# EAGLE design circuit (EAGLE 7.5.0)
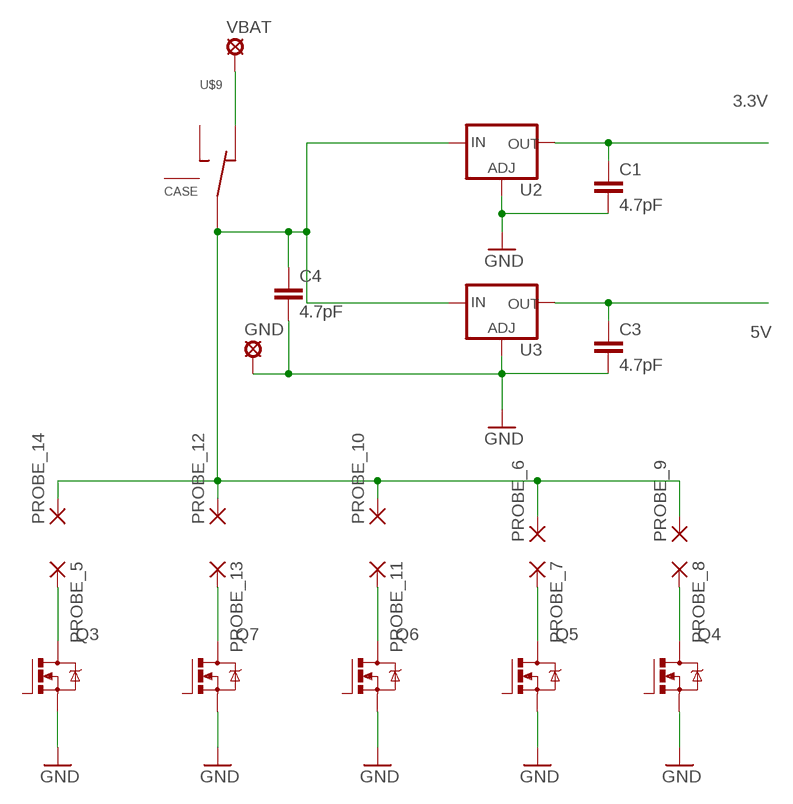
[diagram p0: schematic, sheet 1, part 1 of 2]
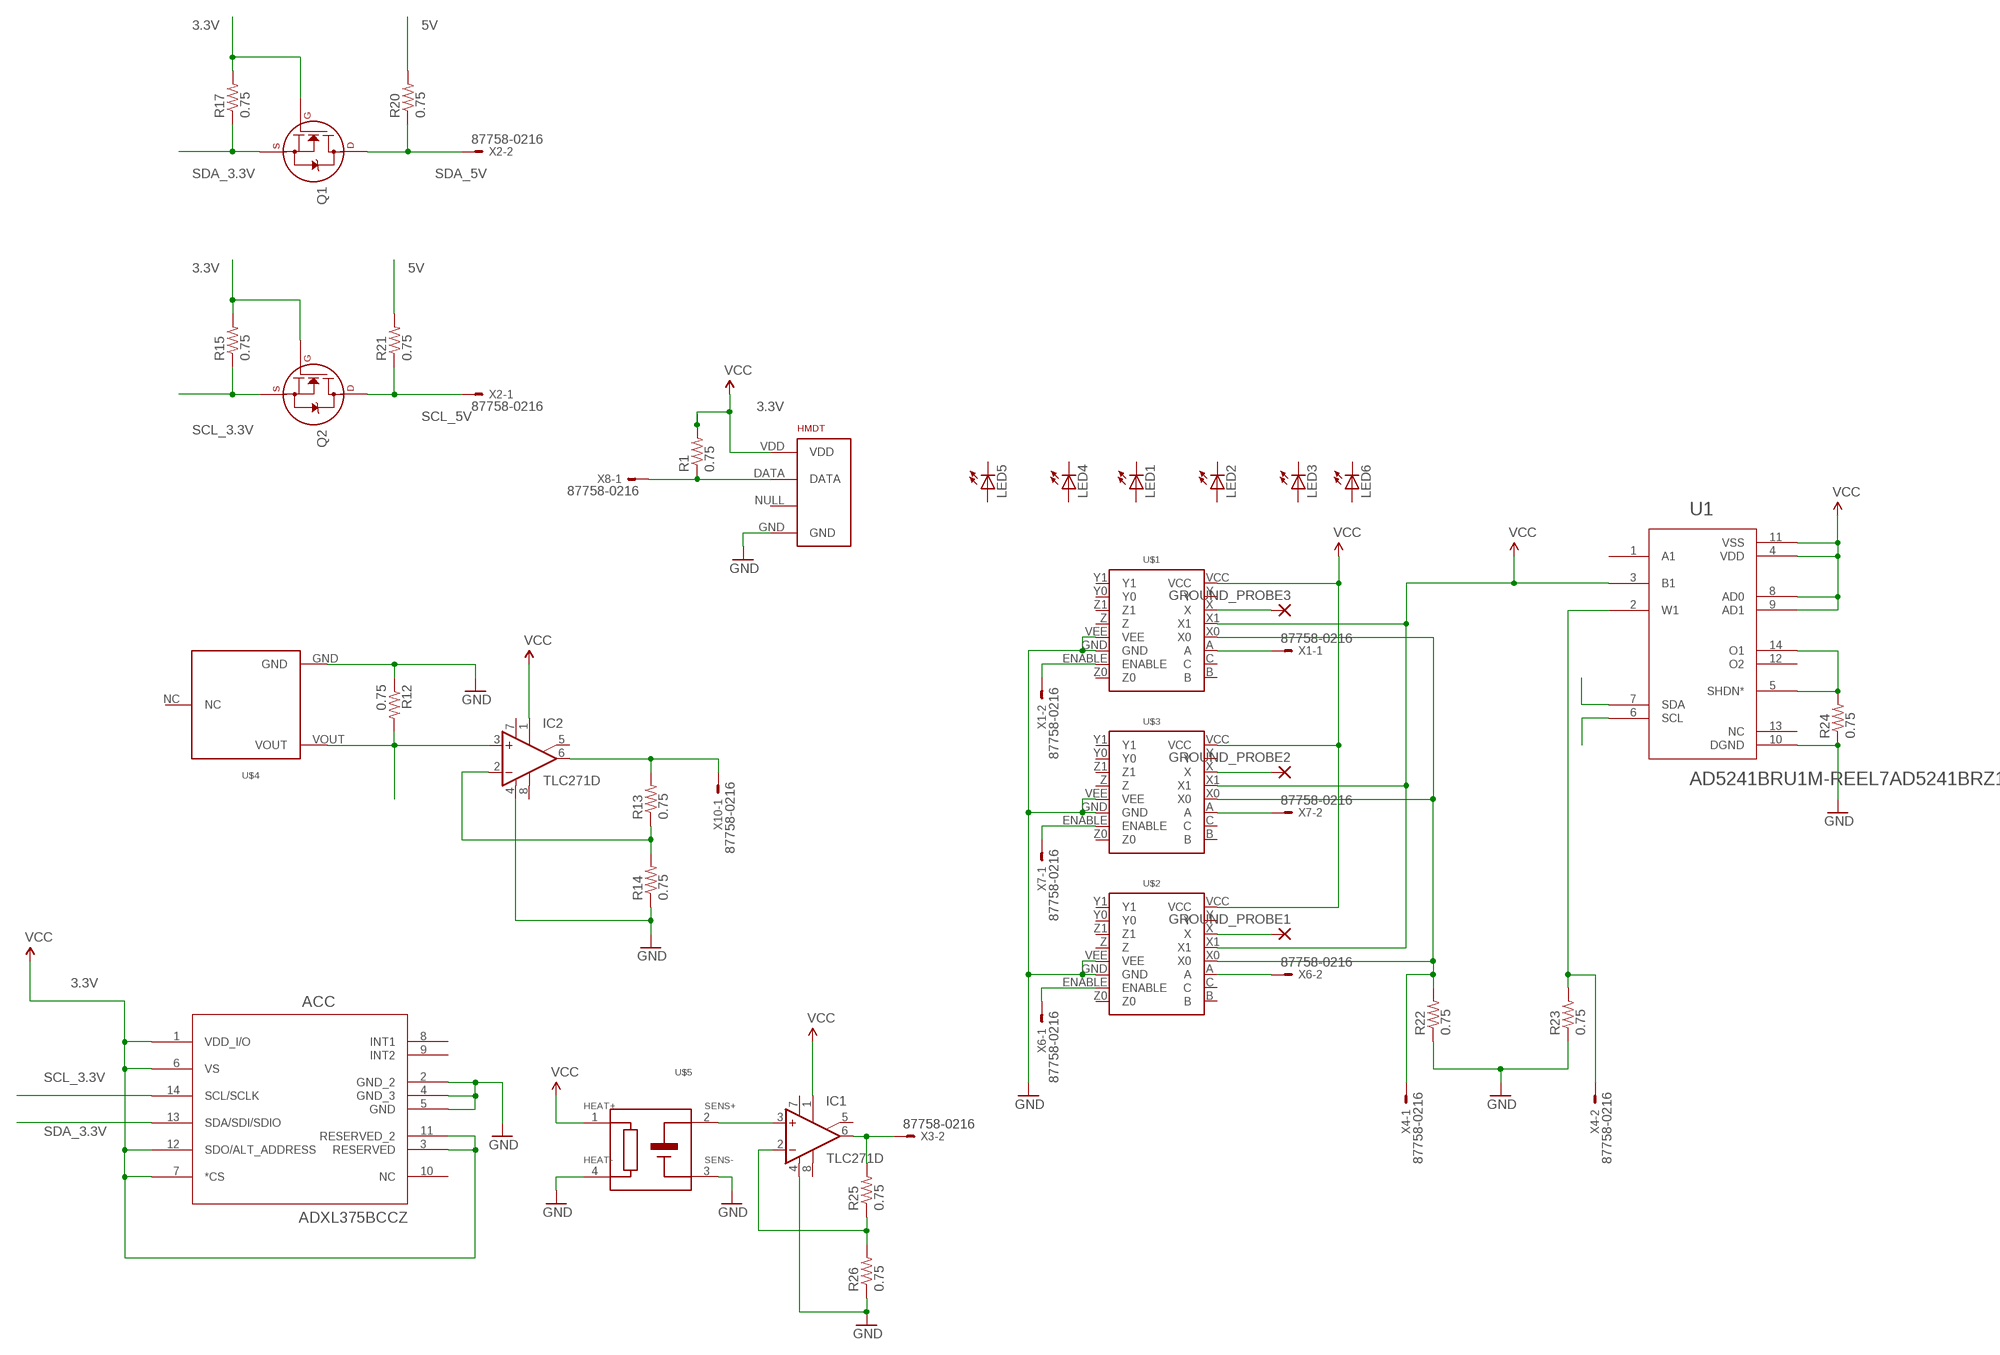
[diagram p1: schematic, sheet 1, part 2 of 2]

## Parts
ACC  ADXL375BCCZ  [LGA_CC-14-1]
C1  4.7pF  4.7PF-50V(-/+.25PF)(0603)  [0603-CAP]
C3  4.7pF  4.7PF-50V(-/+.25PF)(0603)  [0603-CAP]
C4  4.7pF  4.7PF-50V(-/+.25PF)(0603)  [0603-CAP]
GND  LSP10  [LSP10]
GROUND_PROBE1  2,54/0,8  [2,54/0,8]
GROUND_PROBE2  2,54/0,8  [2,54/0,8]
GROUND_PROBE3  2,54/0,8  [2,54/0,8]
HMDT  RHT03_DHT-22_AM2302RA  [RHT03_DHT-22/RA]
IC1  TLC271D  [SO08]
IC2  TLC271D  [SO08]
LED1  LEDSML0805  [SML0805]
LED2  LEDSML0805  [SML0805]
LED3  LEDSML0805  [SML0805]
LED4  LEDSML0805  [SML0805]
LED5  LEDSML0805  [SML0805]
LED6  LEDSML0805  [SML0805]
PROBE_5  2,54/0,8  [2,54/0,8]
PROBE_6  2,54/0,8  [2,54/0,8]
PROBE_7  2,54/0,8  [2,54/0,8]
PROBE_8  2,54/0,8  [2,54/0,8]
PROBE_9  2,54/0,8  [2,54/0,8]
PROBE_10  2,54/0,8  [2,54/0,8]
PROBE_11  2,54/0,8  [2,54/0,8]
PROBE_12  2,54/0,8  [2,54/0,8]
PROBE_13  2,54/0,8  [2,54/0,8]
PROBE_14  2,54/0,8  [2,54/0,8]
Q1  2N7002_SOT23  [SOT-23]
Q2  2N7002_SOT23  [SOT-23]
Q3  NTR4501N  [SOT-23]
Q4  NTR4501N  [SOT-23]
Q5  NTR4501N  [SOT-23]
Q6  NTR4501N  [SOT-23]
Q7  NTR4501N  [SOT-23]
R1  0.75  0.75OHM-1/4W-1%(0805)  [0805]
R12  0.75  0.75OHM-1/4W-1%(0805)  [0805]
R13  0.75  0.75OHM-1/4W-1%(0805)  [0805]
R14  0.75  0.75OHM-1/4W-1%(0805)  [0805]
R15  0.75  0.75OHM-1/4W-1%(0805)  [0805]
R17  0.75  0.75OHM-1/4W-1%(0805)  [0805]
R20  0.75  0.75OHM-1/4W-1%(0805)  [0805]
R21  0.75  0.75OHM-1/4W-1%(0805)  [0805]
R22  0.75  0.75OHM-1/4W-1%(0805)  [0805]
R23  0.75  0.75OHM-1/4W-1%(0805)  [0805]
R24  0.75  0.75OHM-1/4W-1%(0805)  [0805]
R25  0.75  0.75OHM-1/4W-1%(0805)  [0805]
R26  0.75  0.75OHM-1/4W-1%(0805)  [0805]
U1  AD5241BRU1M-REEL7AD5241BRZ1M  [SOIC-14]
U2  TLV1117-33  [SOT223]
U3  LD1117S50  [SOT223]
U$1  MC74HC4051A  [SOIC16]
U$2  MC74HC4051A  [SOIC16]
U$3  MC74HC4051A  [SOIC16]
U$4  O2-A2  [O2-A2]
U$5  TGS4161  [TGS4161]
U$9  SS-8  [SS-8]
VBAT  LSP10  [LSP10]
X1  87758-0216  [87758-0216]
X2  87758-0216  [87758-0216]
X3  87758-0216  [87758-0216]
X4  87758-0216  [87758-0216]
X6  87758-0216  [87758-0216]
X7  87758-0216  [87758-0216]
X8  87758-0216  [87758-0216]
X10  87758-0216  [87758-0216]

## Nets
3.3V: ACC.1(VDD_I/O) ACC.3(RESERVED) ACC.6(VS) ACC.7(*CS) ACC.11(RESERVED_2) ACC.12(SDO/ALT_ADDRESS) C1.1 HMDT.VDD Q1.1(G) Q2.1(G) R1.2 R15.2 R17.2 U2.2(OUT) U2.4(OUT) ; supply symbol labelled VCC
5V: C3.1 IC1.1(ON1) IC1.2(-IN) IC2.3(+IN) R12.2 R20.2 R21.2 R25.1 R26.2 U1.3(B1) U1.4(VDD) U1.8(AD0) U1.9(AD1) U1.11(VSS) U3.2(OUT) U3.4(OUT) U$1.VCC U$1.X1 U$2.VCC U$2.X1 U$3.VCC U$3.X1 U$4.VOUT U$5.1(HEAT+) ; supply symbol labelled VCC
GND: ACC.2(GND_2) ACC.4(GND_3) ACC.5(GND) C1.2 C3.2 C4.2 GND.MP HMDT.GND IC1.4(V-) IC2.4(V-) Q3.2(S) Q4.2(S) Q5.2(S) Q6.2(S) Q7.2(S) R12.1 R14.1 R22.1 R23.1 R24.1 R26.1 U1.10(DGND) U2.1(ADJ) U3.1(ADJ) U$1.GND U$1.VEE U$2.GND U$2.VEE U$3.GND U$3.VEE U$4.GND U$5.3(SENS-) U$5.4(HEAT-)
N$2: GROUND_PROBE3.1(P) U$1.X
N$4: IC2.6(OUT) R13.2 X10.1
N$5: GROUND_PROBE2.1(P) U$3.X
N$6: GROUND_PROBE1.1(P) U$2.X
N$8: R23.2 U1.2(W1) X4.2
N$9: R22.2 U$1.X0 U$2.X0 U$3.X0 X4.1
N$10: IC2.2(-IN) R13.1 R14.2
N$11: U$3.ENABLE X7.1
N$12: U$3.A X7.2
N$13: U$2.A X6.2
N$14: U$1.A X1.1
N$15: U$1.ENABLE X1.2
N$16: U$2.ENABLE X6.1
N$18: PROBE_5.1(P) Q3.3(D)
N$19: R24.2 U1.5(SHDN*) U1.14(O1)
N$22: IC1.3(+IN) U$5.2(SENS+)
N$23: PROBE_8.1(P) Q4.3(D)
N$24: IC1.6(OUT) R25.2 X3.2
N$27: PROBE_7.1(P) Q5.3(D)
N$29: PROBE_11.1(P) Q6.3(D)
N$30: PROBE_13.1(P) Q7.3(D)
N$33: U$9.P2 VBAT.MP
N$55: HMDT.DATA R1.1 X8.1
SCL_3.3V: ACC.14(SCL/SCLK) Q2.2(S) R15.1 U1.6(SCL)
SCL_5V: Q2.3(D) R21.1 X2.1
SDA_3.3V: ACC.13(SDA/SDI/SDIO) Q1.2(S) R17.1 U1.7(SDA)
SDA_5V: Q1.3(D) R20.1 X2.2
VBAT: C4.1 PROBE_6.1(P) PROBE_9.1(P) PROBE_10.1(P) PROBE_12.1(P) PROBE_14.1(P) U2.3(IN) U3.3(IN) U$9.COM
Unconnected: ACC.8(INT1) ACC.9(INT2) ACC.10(NC) HMDT.NULL IC1.5(ON2) IC1.8(OPT) IC2.1(ON1) IC2.5(ON2) IC2.8(OPT) LED1.A LED1.C LED2.A LED2.C LED3.A LED3.C LED4.A LED4.C LED5.A LED5.C LED6.A LED6.C Q3.1(G) Q4.1(G) Q5.1(G) Q6.1(G) Q7.1(G) U1.1(A1) U1.12(O2) U1.13(NC) U$1.B U$1.C U$1.Y U$1.Y0 U$1.Y1 U$1.Z U$1.Z0 U$1.Z1 U$2.B U$2.C U$2.Y U$2.Y0 U$2.Y1 U$2.Z U$2.Z0 U$2.Z1 U$3.B U$3.C U$3.Y U$3.Y0 U$3.Y1 U$3.Z U$3.Z0 U$3.Z1 U$4.NC U$9.CASE_L(CASE) U$9.CASE_R(CASE) U$9.P1 X3.1 X8.2 X10.2

## Power pins joined to a net without a drawn wire
V+: IC1.7(V+) IC2.7(V+)

## Library data of the parts
ACC = elements:ADXL375BCCZ
C1 C3 C4 = SparkFun-Capacitors:4.7PF-50V(-/+.25PF)(0603): CAP-07880; PROD_ID: CAP-07880
GND VBAT = solpad:LSP10: SOLDER PAD drill 1.0 mm, distributor Buerklin, 12H555
GROUND_PROBE1-GROUND_PROBE3 PROBE_5-PROBE_14 = wirepad:2,54/0,8: THROUGH-HOLE PAD
HMDT = RHT03_DHT-22_AM2302:RHT03_DHT-22_AM2302: RHT03 / DHT-22 / AM2302 Packages and symbol for the RHT03 / DHT-22 relative humidity and temperature sensor. Note: The AM2302 is a wired version of the DHT-22 which typically requires less clearance and is thus provided as a separate package.; PROD_ID: SEN-10167
IC1 IC2 = linear:TLC271: OP AMP
LED1-LED6 = led:LED: LED OSRAM: - CHIPLED LG R971, LG N971, LY N971, LG Q971, LY Q971, LO R971, LY R971 LH N974, LH R974 LS Q976, LO Q976, LY Q976 LO Q996 - Hyper CHIPLED LW Q18S LB Q993, LB Q99A, LB R99A - SideLED LS A670, LO A670, LY A670, LG A670, LP A670 LB A673, LV A673, LT A673, LW A673 LH A674 LY A675 LS A676, LA A676, LO A676, LY A676, LW A676 LS A679, LY A679, LG A679 - Hyper Micro SIDELED® LS Y876, LA Y876, LO Y876, LY Y876 LT Y87S - SmartLED LW L88C, LW L88S LB L89C, LB L89S, LG L890 LS L89K, LO L89K, LY L89K LS L896, LA L896, LO L896, LY L896 - TOPLED LS T670, LO T670, LY T670, LG T670, LP T670 LSG T670, LSP T670, LSY T670, LOP T670, LYG T670 LG T671, LOG T671, LSG T671 LB T673, LV T673, LT T673, LW T673 LH T674 LS T676, LA T676, LO T676, LY T676, LB T676, LH T676, LSB T676, LW T676 LB T67C, LV T67C, LT T67C, LS T67K, LO T67K, LY T67K, LW E67C LS E67B, LA E67B, LO E67B, LY E67B, LB E67C, LV E67C, LT E67C LW T67C LS T679, LY T679, LG T679 LS T770, LO T770, LY T770, LG T770, LP T770 LB T773, LV T773, LT T773, LW T773 LH T774 LS E675, LA E675, LY E675, LS T675 LS T776, LA T776, LO T776, LY T776, LB T776 LHGB T686 LT T68C, LB T68C - Hyper Mini TOPLED® LB M676 - Mini TOPLED Santana® LG M470 LS M47K, LO M47K, LY M47K Source: http://www.osram.convergy.de LUXEON: - LUMILED® LXK2-PW12-R00, LXK2-PW12-S00, LXK2-PW14-U00, LXK2-PW14-V00 LXK2-PM12-R00, LXK2-PM12-S00, LXK2-PM14-U00 LXK2-PE12-Q00, LXK2-PE12-R00, LXK2-PE12-S00, LXK2-PE14-T00, LXK2-PE14-U00 LXK2-PB12-K00, LXK2-PB12-L00, LXK2-PB12-M00, LXK2-PB14-N00, LXK2-PB14-P00, LXK2-PB14-Q00 LXK2-PR12-L00, LXK2-PR12-M00, LXK2-PR14-Q00, LXK2-PR14-R00 LXK2-PD12-Q00, LXK2-PD12-R00, LXK2-PD12-S00 LXK2-PH12-R00, LXK2-PH12-S00 LXK2-PL12-P00, LXK2-PL12-Q00, LXK2-PL12-R00 Source: www.luxeon.com KINGBRIGHT: KA-3528ASYC Source: www.kingbright.com
Q1 Q2 = transistors:2N700*: 2N7000, 2N7002, NDS7002A N-channel enhancement mode MOSFET
Q3-Q7 = elements:NTR4501N: NTR4501N, NVR4501N Power MOSFET 20 V, 3.2 A, Single N−Channel, SOT−23 http://www.onsemi.ru.com/pub_link/Collateral/NTR4501N-D.PDF
R1 R12-R15 R17 R20-R26 = SparkFun-Resistors:0.75OHM-1/4W-1%(0805): RES-08474; PROD_ID: RES-08474
U1 = elements:AD5241BRU1M-REEL7
U2 = elements:TLV1117-33: Voltage Regulator LM1117 Standard adjustable voltage regulator but in SMD form. Spark Fun Electronics SKU : COM-00595
U3 = elements:LD1117S50: Voltage Regulator LM1117 Standard adjustable voltage regulator but in SMD form. Spark Fun Electronics SKU : COM-00595
U$1-U$3 = elements:MC74HC4051A
U$4 = datchiki:O2-A2: O2-A2 Oxy O2-A2 Oxygen Sensor en Sensor http://www.alphasense.com/WEB1213/wp-content/uploads/2015/09/O2A2.pdf
U$5 = datchiki:TGS4161: TGS4161 The Figaro TGS4161 is a new solid electrolyte type sensor which offers miniaturization, low power consumption, and long life. The TGS4161 displays high selectivity to carbon dioxide. Also, the TGS4161 displays good long term stability and shows excellent durability against the effects of high humidity through the application of innovative technology in the sensor’s electrode design. http://www.netzmafia.de/skripten/hardware/Datenblaetter/Gassensoren/TGS4161Dtl.pdf
U$9 = elements:SS-8: SS-8 Наименование: Переключатель мини 3 конт. прям. уг.тип 8 Производитель: Тайвань (Китай) http://www.brownbear.ru/components/ss-8.html
X1-X4 X6-X8 X10 = con-molex:87758-0216: 2 Pin - 2mm Dual Row Single Wafer, Vertical T/H HDR Source: http://www.molex.com/pdm_docs/sd/877580616_sd.pdf; MPN: 87758-0216; OC_FARNELL: unknown; OC_NEWARK: 94M1513

## Board
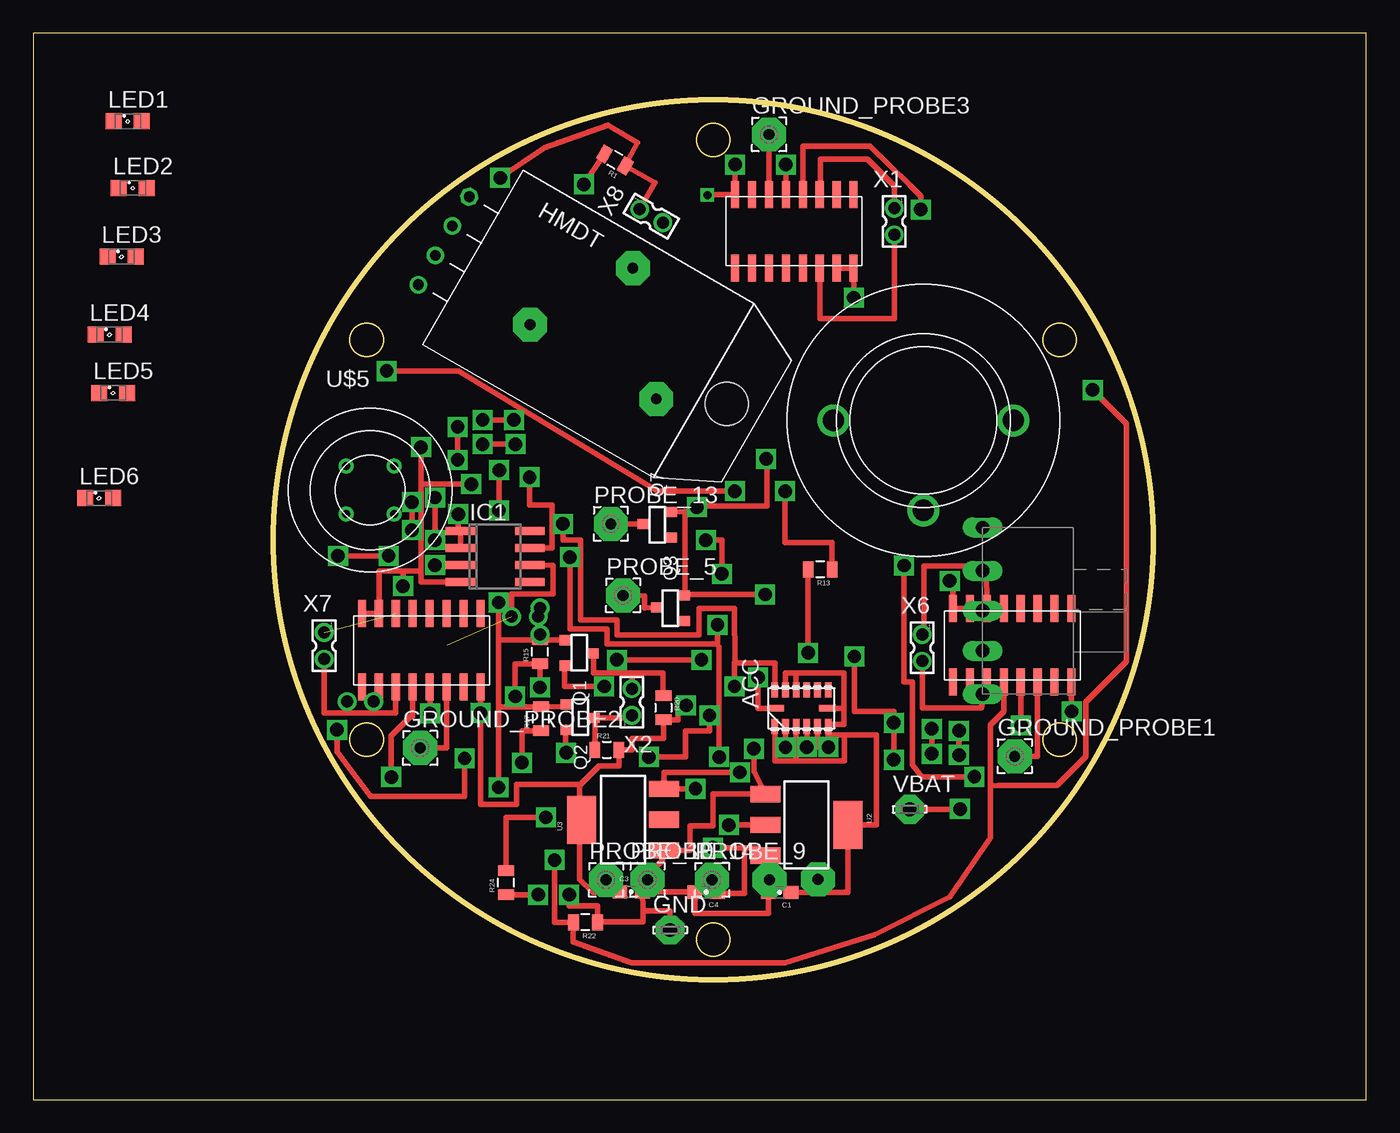
[diagram p2: board, top side]
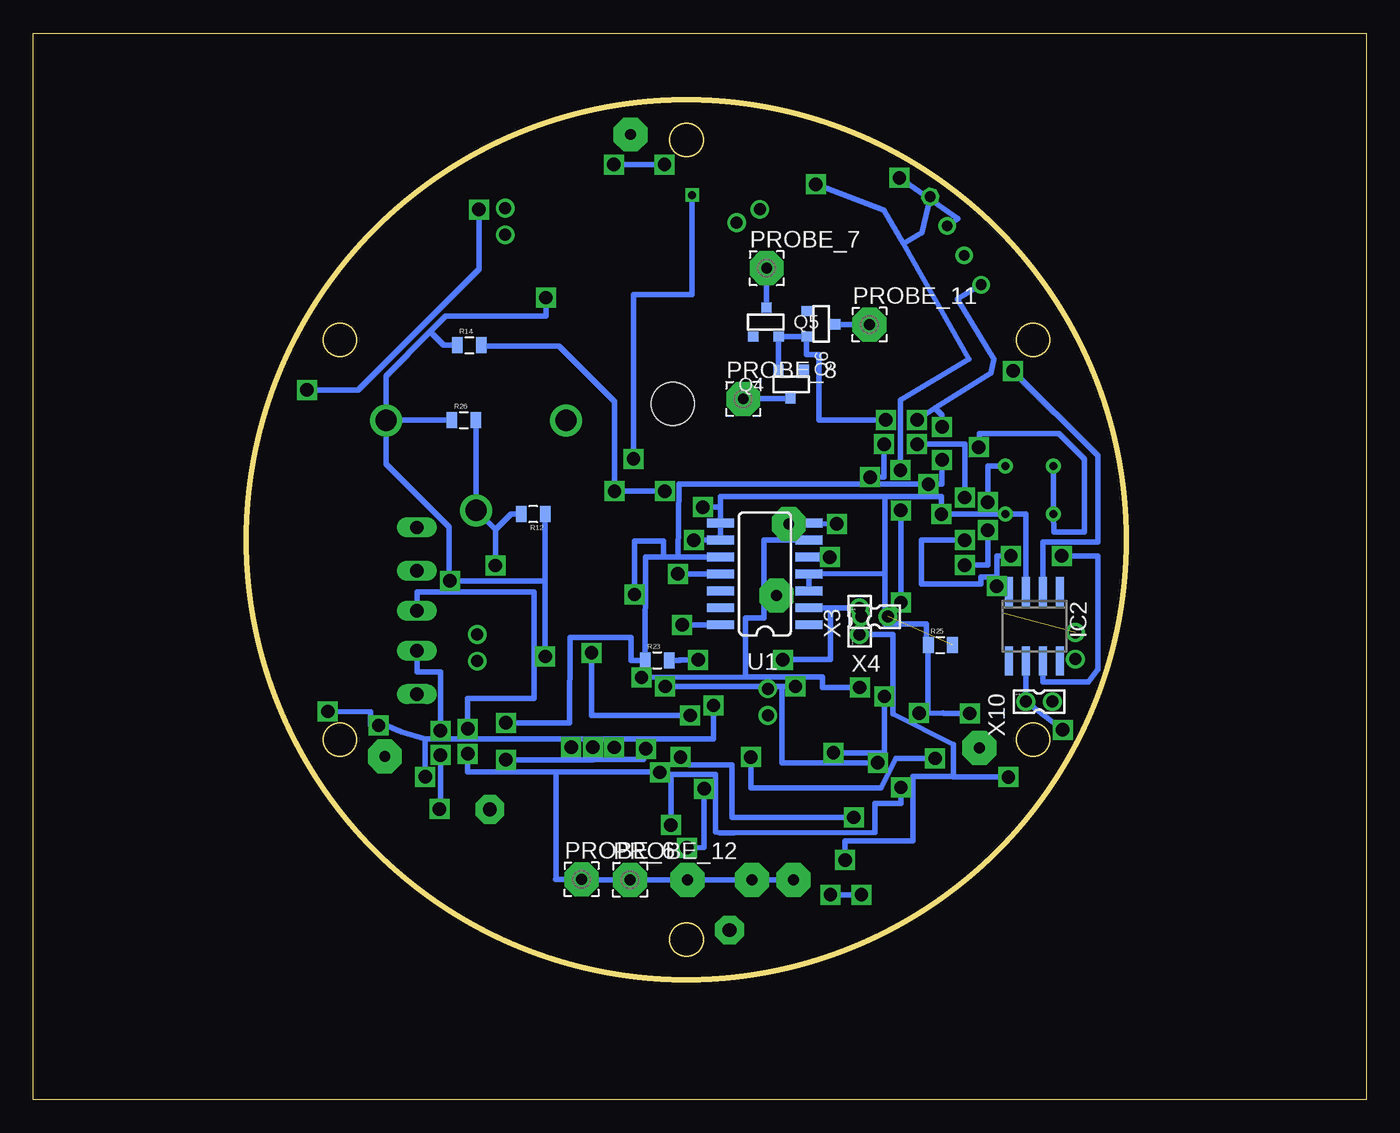
[diagram p3: board, bottom side, seen from below]

Size 100 x 80 mm. Coordinates in mm from the lower left corner, seen from the top.
Outline: 0,0 100,0 100,80 0,80 0,0
Outline: circle at 51,42 radius 33
Outline: circle at 25,27 radius 1.25
Outline: circle at 77,27 radius 1.25
Outline: circle at 51,72 radius 1.25
Outline: circle at 25,57 radius 1.25
Outline: circle at 77,57 radius 1.25
Outline: circle at 51,12 radius 1.25
Copper layers (1*16): Top 0.035mm / dielectric 1.5mm / Bottom 0.035mm
Design rules "default": minimum track width 10mil, minimum drill 24mil, track to track 8mil, track to pad 8mil, pad to pad 8mil, via to via 8mil, smd to smd 8mil, copper to edge 40mil, drill to drill 8mil, minimum pad ring 10mil, minimum via ring 8mil, stop-mask expansion 4mil, vias tented up to drill 0mil, thermal gap 10mil

### Footprints (pad centres in the part's own frame; a part is rotated, then mirrored left to right if it is on the bottom)
LGA_CC-14-1 = smd 1.118 x 0.5: 1 -1.371,2; 2 -1.371,1.2; 3 -1.371,0.4; 4 -1.371,-0.4; 5 -1.371,-1.2; 6 -1.371,-2; 8 1.371,-2; 9 1.371,-1.2; 10 1.371,-0.4; 11 1.371,0.4; 12 1.371,1.2; 13 1.371,2 | smd 0.5 x 1.118: 7 0,-1.871; 14 0,1.871
0603-CAP = smd 1.1 x 1: 1 -0.85,0; 2 0.85,0
LSP10 = drill 1.016 pad 2.159 octagon: MP 0,0
2,54/0,8 = drill 0.813 pad 2.54 octagon: 1 0,0
RHT03_DHT-22/RA = drill 0.8: DATA -1.27,0; GND 3.81,0; NULL 1.27,0 | drill 0.8 octagon: VDD -3.81,0 | hole 3.25: 0,24.5
SO08 = smd 0.6 x 2.2: 1 -1.905,-2.6; 2 -0.635,-2.6; 3 0.635,-2.6; 4 1.905,-2.6; 5 1.905,2.6; 6 0.635,2.6; 7 -0.635,2.6; 8 -1.905,2.6
SML0805 = smd 1.2 x 1.2: A 1.05,0; C -1.05,0
SOT-23 = smd 0.762 x 0.762: 1 -0.979,-1.101; 2 0.94,-1.101; 3 0.025,1.067
0805 = smd 0.8 x 1.2: 1 -0.9,0; 2 0.9,0
SOIC-14 = smd 0.66 x 2.032: 1 -4.445,-3.315; 2 -3.175,-3.315; 3 -1.905,-3.315; 4 -0.635,-3.315; 5 0.635,-3.315; 6 1.905,-3.315; 7 3.175,-3.315; 8 3.175,3.315; 9 1.905,3.315; 10 0.635,3.315; 11 -0.635,3.315; 12 -1.905,3.315; 13 -3.175,3.315; 14 -4.445,3.315
SOT223 = smd 1.219 x 2.235: 1 -2.311,-3.099; 2 0,-3.099; 3 2.311,-3.099 | smd 3.6 x 2.2: 4 0,3.099
SOIC16 = smd 2.03 x 0.61: A 5.33,3.17; B 5.33,1.9; C 5.33,0.63; ENABLE -0.17,3.17; GND -0.17,0.63; VCC 5.33,9.52; VEE -0.17,1.9; X 5.33,6.98; X0 5.33,4.44; X1 5.33,5.71; Y 5.33,8.25; Y0 -0.17,8.25; Y1 -0.17,9.52; Z -0.17,5.71; Z0 -0.17,4.44; Z1 -0.17,6.98
O2-A2 = drill 1.6: GND 6.75,0; NC -6.75,0; VOUT 0,-6.75
TGS4161 = drill 0.6: 1 1.8,-1.8; 2 1.8,1.8; 3 -1.8,1.8; 4 -1.8,-1.8
SS-8 = drill 1 long: CASE_L -6.25,-3.81; CASE_R 6.25,-3.81; COM 0,-3.81; P1 -3,-3.81; P2 3,-3.81
87758-0216 = drill 0.9 pad 1.27: 1 0,-1; 2 0,1

### Placement (x,y rotation side)
ACC  57.62,29.36 90 top
C1  55.99,15.54 180 top
C3  44.85,15.58 0 top
C4  50.48,15.57 180 top
GND  47.77,12.72 0 top
GROUND_PROBE1  73.63,25.75 0 top
GROUND_PROBE2  29.02,26.37 0 top
GROUND_PROBE3  55.2,72.41 0 top
HMDT  30.8,64.44 240 top
IC1  34.65,40.75 270 top
IC2  24.89,35.51 180 bottom
LED1  7.09,73.39 0 top
LED2  7.47,68.39 0 top
LED3  6.62,63.25 0 top
LED4  5.71,57.4 0 top
LED5  5.99,53.02 0 top
LED6  4.94,45.12 0 top
PROBE_5  44.26,37.81 0 top
PROBE_6  58.87,16.52 0 bottom
PROBE_7  44.98,62.37 0 bottom
PROBE_8  46.74,52.57 0 bottom
PROBE_9  50.92,16.47 0 top
PROBE_10  42.98,16.48 0 top
PROBE_11  37.26,58.15 0 bottom
PROBE_12  55.22,16.49 0 bottom
PROBE_13  43.33,43.19 0 top
PROBE_14  46.07,16.49 0 top
Q1  40.98,33.48 270 top
Q2  41.05,28.66 270 top
Q3  47.77,36.89 90 top
Q4  43.16,53.65 180 bottom
Q5  45.01,58.35 0 bottom
Q6  40.88,58.19 270 bottom
Q7  46.8,43.15 90 top
R1  43.63,70.51 150 top
R12  62.5,43.92 180 bottom
R13  59.02,39.77 180 top
R14  67.3,56.6 0 bottom
R15  38,33.6 90 top
R17  38.08,28.57 90 top
R20  47.27,29.4 270 top
R21  43.02,26.25 0 top
R22  41.42,13.3 180 top
R23  53.2,32.95 0 bottom
R24  35.45,16.27 90 top
R25  31.95,34.1 0 bottom
R26  67.7,50.98 0 bottom
U1  45.12,40.07 90 bottom
U2  58.02,20.61 270 top
U3  44.23,21 90 top
U$1  62.17,62.55 90 top
U$2  68.36,36.67 270 top
U$3  24.02,36.3 270 top
U$4  66.78,50.95 0 top
U$5  25.27,45.73 0 top
U$9  75.03,36.67 270 top
VBAT  65.75,21.77 0 top
X1  64.59,65.88 180 top
X2  44.9,29.82 0 top
X3  36.88,36.23 270 bottom
X4  38.01,35.88 0 bottom
X6  66.69,33.89 180 top
X7  21.82,34.04 180 top
X8  46.36,66.3 240 top
X10  24.54,29.86 270 bottom

### Tracks (layer width: path | path; a pad name or v marks a point on that pad's centre or on a via)
3.3V  (via drill 1)
  Top 0.406: Q2.1 39.95,29.5 R17.2 34.9,29.48 | 34.9,34.5 R15.2 38,34.46 Q1.1 | 34.9,34.5 34.9,29.48 | 57.23,25.4 60.85,25.4 60.85,27.35 | 57.23,25.4 ACC.3 | 60.85,27.35 59.62,27.35 ACC.6 59.67,28.25 59.67,28.15 60.83,28.15 60.83,29.36 | ACC.1 55.62,25.4 57.23,25.4 | 57.23,32 56.42,32 ACC.12 | ACC.11 57.23,32 | 57.23,32 60.83,32 60.83,29.36 | 60.83,29.36 ACC.7 | 60.85,27.35 63.25,27.35 63.25,20.61 U2.4 61.12,21.18 61.12,15.55 57.06,15.55 C1.1 | 34.9,29.48 v34.9,23.43 | v52.17,20.6 52.67,20.61 U2.2 | v34.95,47.23 v34.92,44.2 | v34.9,37.3 34.9,34.5 | R1.2 v41.3,68.67
  Bottom 0.406: v34.9,23.43 34.9,22.23 36.88,22.23 36.88,20.05 47.45,20.02 48.5,20.02 48.83,20.07 48.83,24.4 52.17,24.4 v52.17,20.6 | HMDT.VDD 33.35,65.05 34.73,64.22 | 34.73,64.22 29.82,55.55 34.95,52.48 v34.95,47.23 | v34.92,44.2 v34.9,37.3 | v41.3,68.67 36.2,66.72 34.73,64.22
5V  (via drill 0.6, 1)
  Top 0.406: C3.1 44,15.55 41.98,15.53 40.98,16.53 40.98,21.2 | 40.98,21.2 U3.4 | U$3.VCC v33.55,29 33.55,22.15 36.25,22.15 36.25,23.65 40.98,23.65 40.98,23.57 | v29.75,28.98 29.75,30.97 U$3.X1 | v74.1,28.07 74.1,31.34 U$2.X1 74.08,29.3 | v77.9,29.12 77.89,29.55 U$2.VCC | 40.98,21.2 40.98,23.57 | 40.98,23.57 42.42,25.02 43.95,25.02 43.92,25.05 R21.2 43.92,26.23 44.92,26.23 44.92,27.1 47.27,27.1 R20.2 48.35,28.5 48.35,29.57 v48.98,29.57 | IC1.2 IC1.1 31.88,42.63 v31.88,43.92 | v50.45,41.98 51.65,41.98 v51.65,39.45 | v65.33,40.08 65.33,31.32 65.95,31.32 65.95,25.12 66.67,24.23 v70.6,24.23 | v52.65,70.15 U$1.VCC 50.62,67.89 v50.58,67.88 | v56.45,70.15 U$1.X1 | v49.77,44.45 49.77,44.55 55.02,44.55 55.02,48.08 v54.98,48.08
  Bottom 0.406: 32.88,28.99 33.42,29 v33.55,29 | 32.88,28.99 31.7,28.96 | 31.7,28.96 v29.75,28.98 | v77.9,29.12 74.7,29.1 74.7,28.07 v74.1,28.07 73.55,28.07 72.38,27.57 70.62,27.07 | v48.98,29.57 48.98,27.07 70.62,27.07 | U1.3 U1.4 36.12,39.48 | 36.12,39.48 36.12,45.25 | 36.12,45.25 48.44,45.25 48.44,44.45 | 48.44,44.45 U1.8 U1.9 v50.45,41.98 | v51.65,39.45 U1.11 | 36.12,45.25 31.88,45.25 v31.88,43.92 U$5.1 25.52,43.92 IC2.3 25.52,38.33 | 31.77,28.99 31.7,28.96 | v65.33,40.08 65.33,42.77 | 65.33,42.77 U$4.VOUT 66.78,50.95 R26.2 | v70.6,24.23 70.62,27.07 | v52.65,70.15 v56.45,70.15 | 48.44,44.45 v49.77,44.45 | v54.98,48.08 54.98,60.4 50.58,60.4 v50.58,67.88 | R25.1 32.88,34.1 | 32.88,34.1 32.88,28.99 | 32.88,34.1 33,34.1 33,35.7 36.12,35.7 36.12,39.48 | R12.2 64.17,43.92 65.33,42.77
GND  (via drill 1)
  Top 0.406: C3.2 C4.2 49.62,13.97 55.16,13.97 C1.2 | C3.2 45.73,14.27 45.73,14.18 | C3.2 45.7,16.45 47.2,17.95 U3.1 49.25,18.69 49.25,20.55 50.98,20.55 50.98,22.92 U2.1 54.05,24.62 v54.05,26.32 | ACC.4 v58.02,26.45 | v56.42,26.43 ACC.2 | ACC.5 58.83,26.45 v59.65,26.45 | v64.55,25.5 v64.55,28.27 64.55,29.12 61.6,29.12 v61.6,33.25 | U$2.VEE U$2.GND 69,38.68 v68.75,38.92 | 29.07,39.67 29.07,46.17 | U$1.VEE U$1.GND v61.55,60.17 | 29.07,46.17 v32.85,46.17 | Q7.2 48.88,44.12 Q3.2 48.88,37.9 v54.9,37.9 | v36.05,51 v33.7,51 | v31.82,48 v31.82,50.48 | 45.73,14.18 47.75,14.18 47.75,12.72 GND.MP | R24.1 v37.88,15.38 | v40.2,15.38 40.2,14.55 42.33,14.55 R22.1 42.33,13.32 45.73,13.32 45.73,14.18 | 24.68,36.47 U$3.GND U$3.VEE 25.93,39.67 27.73,39.67 | 29.07,39.67 27.73,39.67 | v29.07,48.95 29.07,46.17 | v27.73,38.52 27.73,39.67 | 29.07,39.67 29.07,38.84 IC1.4
  Bottom 0.406: v58.02,26.45 58.02,25.5 | 58.02,25.5 56.42,25.52 | v59.65,26.45 59.65,25.5 | 59.65,25.5 58.02,25.5 | 56.42,25.52 v56.42,26.43 | U$5.3 U$5.4 23.45,42.6 21.15,42.6 21.15,48.05 23.07,49.98 29.02,49.98 29.02,48.98 v29.07,48.95 | U1.10 51.62,40.7 | v64.55,25.5 59.65,25.5 | 52.73,40.7 54.08,40.7 R23.1 55.15,32.95 55.15,34.67 59.73,34.67 59.77,28.27 v64.55,28.27 | 52.73,40.7 51.62,40.7 | 56.42,25.52 54.23,25.52 v54.05,26.32 | v61.6,33.25 61.6,38.92 | 61.6,38.92 v68.75,38.92 68.8,38.98 68.8,42.95 73.53,47.68 U$4.GND | U$4.GND 73.53,54.27 70.23,57.6 | 70.23,57.6 69.08,58.77 61.55,58.77 v61.55,60.17 | 51.62,40.7 51.58,46.2 v32.85,46.17 31.82,46.17 v31.82,48 | v54.9,37.9 54.9,41.9 52.73,41.9 52.73,40.7 | v33.7,51 32.35,51.86 | 32.35,51.86 28.15,54.5 27.93,55.55 30.68,60.08 HMDT.GND | Q4.2 44.1,57.25 Q5.2 Q6.2 arc90 Q6.2 41.98,55.9 41.08,55.9 41.08,51 v36.05,51 | v31.82,50.48 31.82,51.34 32.35,51.86 | v37.88,15.38 v40.2,15.38 | v27.73,38.52 26.79,38.52 IC2.4 | R12.1 61.6,38.92 | R14.1 69.23,56.6 70.23,57.6 | R26.1 73.51,50.98 U$4.GND
N$2
  Top 0.406: GROUND_PROBE3.1 55.19,71.98 U$1.X
N$4  (via drill 1)
  Top 0.406: R13.2 v58.12,33.52 | v50.73,28.82 50.73,27.65 48.92,27.65 48.92,25.7 v46.17,25.7 | v32.35,25.6 32.35,22.75 25.3,22.75 22.77,26.1 v22.77,27.75
  Bottom 0.406: IC2.6 25.52,29.86 X10.1 v22.77,27.75 | v58.12,33.52 58.12,28.82 v50.73,28.82 | v46.17,25.7 46.17,23.4 36.4,23.4 35.27,25.6 v32.35,25.6
N$5
  Top 0.406: GROUND_PROBE2.1 31,26.37 U$3.X
N$6
  Top 0.406: GROUND_PROBE1.1 75.34,25.75 U$2.X
N$8  (via drill 1)
  Top 0.406: v43.77,33 v50.12,33
  Bottom 0.406: U1.2 40.2,36.9 | 40.2,36.9 38.86,36.9 X4.2 | R23.2 51.52,32.95 51.52,33 v50.12,33 | 40.2,36.9 40.2,33.02 43.77,33.02 v43.77,33
N$9  (via drill 1)
  Top 0.406: U$1.X0 57.76,71.55 62.77,71.55 65.75,68.6 66.58,67.78 v66.58,66.78 | U$3.X0 28.45,28.75 28.3,28.75 26.85,27.3 v26.85,24.2 | v39.1,17.98 39.1,13.3 R22.2 40.48,11.82 44.88,10.28 56.4,10.28 63.1,12.38 68.78,15.22 71.8,19.65 71.8,23.55 | U$2.X0 72.81,29.11 71.8,28.1 71.8,23.55 | v79.47,53.25 82,50.73 82,32.88 78.97,29.85 78.97,25.75 76.8,23.57 72.42,23.57 71.8,23.55
  Bottom 0.406: v66.58,66.78 66.58,62.3 75.62,53.25 v79.47,53.25 | 30.98,24.2 30.97,26.63 35.5,28.93 35.5,33.83 35.51,34.88 X4.1 | v39.1,17.98 39.1,19.43 34.02,19.43 34.02,24.24 31,24.24 | 31,24.24 30.94,24.24 | 30.98,24.2 v26.85,24.2 | 30.98,24.2 31,24.24
N$10  (via drill 1)
  Top 0.406: v26.5,54.67 31.9,54.65 46.83,45.67 v52.62,45.65 | v56.4,45.65 56.4,41.8 59.92,41.8 R13.1
  Bottom 0.406: IC2.2 24.25,41.85 20.12,41.85 20.12,48.33 v26.5,54.67 | v52.62,45.65 v56.4,45.65 56.4,52.38 60.58,56.55 66.35,56.55 R14.2
N$11  (1 unrouted)
  Top 0.406: 27.23,36.47 U$3.ENABLE
N$12
  Top 0.406: X7.2 21.82,29 27.18,29 27.18,30.97 U$3.A
N$13
  Top 0.406: X6.2 66.72,29.4 71.12,29.4 71.55,31.34 U$2.A
N$14
  Top 0.406: U$1.A 59.05,68.76 59.05,70.55 62.58,70.55 64.6,68.53 64.6,66.71 X1.1
N$15
  Top 0.406: U$1.ENABLE 59,58.6 64.6,58.6 X1.2
N$16
  Top 0.406: U$2.ENABLE 71.51,40.05 66.8,40.05 66.8,34.99 X6.1
N$18
  Top 0.406: PROBE_5.1 45.85,37.77 45.85,36.9 Q3.3
N$19  (via drill 1)
  Top 0.406: v51.33,35.62 51.33,34.17 | 51.33,34.17 51.45,33.98 v51.45,25.7 | 51.33,34.17 43.02,34.17 43.02,35.3 40.25,35.3 v40.25,40.7 | R24.2 35.45,21.18 v38.45,21.18
  Bottom 0.406: U1.14 v51.33,35.62 | v40.25,40.7 U1.5 | v38.45,21.18 47.58,21.18 47.58,25.1 50.83,25.1 v51.45,25.7
N$22  (via drill 1)
  Top 0.406: IC1.3 32.05,40.1 v30.12,40.1 | v28.4,42.73 v28.4,44.83
  Bottom 0.406: 27.1,47.55 U$5.2 28.4,47.52 v28.4,44.83 | v30.12,40.1 28.4,40.1 v28.4,42.73
N$23
  Bottom 0.406: Q4.3 46.74,52.58 PROBE_8.1
N$24  (1 unrouted)
  Top 0.406: IC1.6 39,40.08 39,37.92 35.88,37.92 X3.2
N$27
  Bottom 0.406: Q5.3 PROBE_7.1
N$29
  Bottom 0.406: PROBE_11.1 arc-90 37.27,58.16 Q6.3
N$30
  Top 0.406: PROBE_13.1 Q7.3
N$33  (via drill 1)
  Top 0.406: v69.45,27.68 v69.45,25.85 | v69.53,21.8 69.53,21.77 VBAT.MP
  Bottom 0.406: U$9.P2 71.22,32.1 69.45,32.1 v69.45,27.68 | v69.45,25.85 69.45,21.8 v69.53,21.8
N$55  (via drill 1)
  Top 0.406: v35.02,69.15 38.35,71.42 43.1,73.1 45.33,71.8 R1.1 46.65,68.8 X8.1
  Bottom 0.406: HMDT.DATA 30.62,66.1 v35.02,69.15
SCL_3.3V  (via drill 1)
  Top 0.406: 39.98,27.97 Q2.2 39.95,26.02 v39.98,26.02 | ACC.14 54.38,29.33 v54.38,31.68 | v36.15,30.25 36.15,32.7 R15.1 v38,30.93
  Bottom 0.406: v36.15,30.25 36.15,26.02 v39.98,26.02 | v54.38,31.68 46.57,31.69 | 46.57,31.69 40.8,31.7 40.8,30.93 v38,30.93 | U1.6 45.17,41.98 45.17,36.15 46.57,36.15 46.57,31.69
SCL_5V
  Top 0.406: R21.1 42.12,28.75 Q2.3 44.98,28.64 X2.1
SDA_3.3V  (via drill 1)
  Top 0.406: Q1.2 39.87,31 v42.83,31 | R17.1 36.65,27.68 v36.65,25.27 | ACC.13 55.62,32.77 52.62,32.77 | 52.62,32.77 52.6,32.77 v52.6,31 | v39.73,43.2 39.73,42 41.05,42 41.05,36 43.77,36 43.77,34.85 49.92,34.85 49.92,36.85 52.6,36.85 52.62,32.77
  Bottom 0.406: 43.85,31 43.83,25.27 v36.65,25.27 | 43.85,31 v42.83,31 | v52.6,31 43.85,31 | U1.7 41.8,43.23 v39.73,43.2
SDA_5V
  Top 0.406: 44.9,32.02 42.04,32.02 Q1.3 | 44.9,32.02 X2.2 | R20.1 47.25,30.3 47.25,32.02 44.9,32.02
V+  (via drill 1)
  Top 0.406: v22.85,40.8 v26.65,40.8 | v30.12,41.98 v30.12,45.17 | v33.7,49.17 v36.17,49.17 | v37.23,46.7 37.23,44.62 38.9,44.62 38.9,41.38 IC1.7
  Bottom 0.406: IC2.7 24.25,31.35 20.85,31.35 20.15,32.27 20.15,40.8 v22.85,40.8 | v26.65,40.8 27.73,40.8 27.73,39.23 28.9,39.23 28.9,38.67 33.38,38.67 33.38,41.98 v30.12,41.98 | v30.12,45.17 30.12,49.17 v33.7,49.17 | v36.17,49.17 36.17,46.7 v37.23,46.7
VBAT  (via drill 1)
  Top 0.406: C4.1 51.34,15.47 53.35,15.47 53.35,18.9 | 53.35,18.9 v50.98,18.9 | 53.35,18.9 54.38,18.9 54.38,18.87 U2.3 | v49.67,23.32 v49.67,23.31 U3.3 47.33,24.55 v53,24.55 | v67.4,27.82 v67.4,25.95
  Bottom 0.406: v50.98,18.9 49.67,18.93 v49.67,23.32 | v53,24.55 53,24.57 60.8,24.57 | 60.8,24.57 60.8,16.52 60.83,16.52 PROBE_6.1 58.87,16.49 PROBE_12.1 55.22,16.47 PROBE_9.1 50.92,16.49 PROBE_14.1 PROBE_10.1 | U$9.COM 71.22,38.08 62.45,38.08 62.45,30.1 67.4,30.1 v67.4,27.82 | v67.4,25.95 67.4,24.57 60.8,24.57